# Altium schematic sheet IsolatorTop.SchDoc
size A4
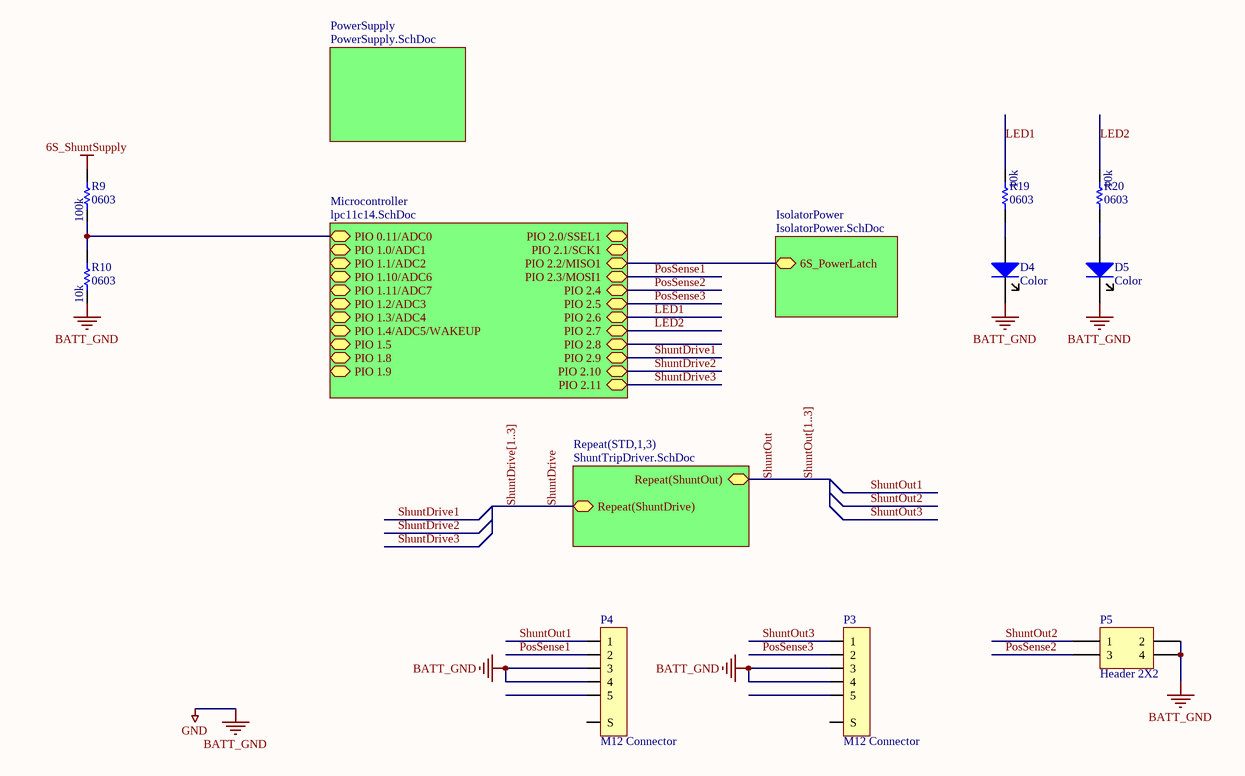
[diagram p0: IsolatorTop.SchDoc]

## Parts
D4  value Color  [CAP_0.1_POL]  (hidden comment: LED)
D5  value Color  [CAP_0.1_POL]  (hidden comment: LED)
P3  M12 Connector  [M12_5P_VERT]
P4  M12 Connector  [M12_5P_VERT]
P5  Header 2X2  [HDR2X2]
R9  value 100k  package: 0603  [0603_M]  (hidden comment: R)
R10  value 10k  package: 0603  [0603_M]  (hidden comment: R)
R19  value 10k  package: 0603  [0603_M]  (hidden comment: R)
R20  value 10k  package: 0603  [0603_M]  (hidden comment: R)

## Sub-sheets
IsolatorPower = IsolatorPower.SchDoc: 6S_PowerLatch
Microcontroller = lpc11c14.SchDoc: PIO 1.0/ADC1, PIO 1.1/ADC2, PIO 1.10/ADC6, PIO 1.11/ADC7, PIO 1.2/ADC3, PIO 1.3/ADC4, PIO 1.4/ADC5/WAKEUP, PIO 1.5, PIO 1.8, PIO 1.9, PIO 0.11/ADC0, PIO 2.6, PIO 2.0/SSEL1, PIO 2.7, PIO 2.3/MOSI1, PIO 2.8, PIO 2.1/SCK1, PIO 2.4, PIO 2.11, PIO 2.5, PIO 2.2/MISO1, PIO 2.9, PIO 2.10
PowerSupply = PowerSupply.SchDoc: no entries
Repeat(STD,1,3) = ShuntTripDriver.SchDoc: Repeat(ShuntOut), Repeat(ShuntDrive)

## Nets
6S_ShuntSupply: R9.1
BATT_GND: D4.2(K) D5.2(K) P3.3 P3.4 P4.3 P4.4 P5.2 P5.4 R10.2  [also labelled GND]
LED1: R19.2 ; sheet Microcontroller/PIO 2.6
LED2: R20.2 ; sheet Microcontroller/PIO 2.7
PosSense1: P4.2 ; sheet Microcontroller/PIO 2.3/MOSI1
PosSense2: P5.3 ; sheet Microcontroller/PIO 2.4
PosSense3: P3.2 ; sheet Microcontroller/PIO 2.5
ShuntDrive: sheet Repeat(STD,1,3)/Repeat(ShuntDrive)
ShuntDrive1: sheet Microcontroller/PIO 2.9
ShuntDrive2: sheet Microcontroller/PIO 2.10
ShuntDrive3: sheet Microcontroller/PIO 2.11
ShuntOut: sheet Repeat(STD,1,3)/Repeat(ShuntOut)
ShuntOut1: P4.1
ShuntOut2: P5.1
ShuntOut3: P3.1
NetD4_1: D4.1(A) R19.1
NetD5_1: D5.1(A) R20.1
NetR9_2: R9.2 R10.1 ; sheet Microcontroller/PIO 0.11/ADC0
(unnamed): sheet IsolatorPower/6S_PowerLatch, sheet Microcontroller/PIO 2.2/MISO1

Not connected (* = marked no-connect by the designer): P3 5 S; P4 5 S

## Buses and harness runs
bus ShuntDrive[1..3]
bus ShuntOut[1..3]

## Library data of the parts
D4 D5 = D LED: Supplier 1: Digi-Key
P3 P4 = M12 Connector: 5 Pin
P5 = Header 2X2: Header, 2-Pin, Dual row; LatestRevisionDate: 17-Jul-2002; LatestRevisionNote: Re-released for DXP Platform.; Publisher: Altium Limited
R9 R10 R19 R20 = R: Resistor; Supplier 1: Digikey